# Altium schematic sheet STM32F100CBT6env.SchDoc
size A4
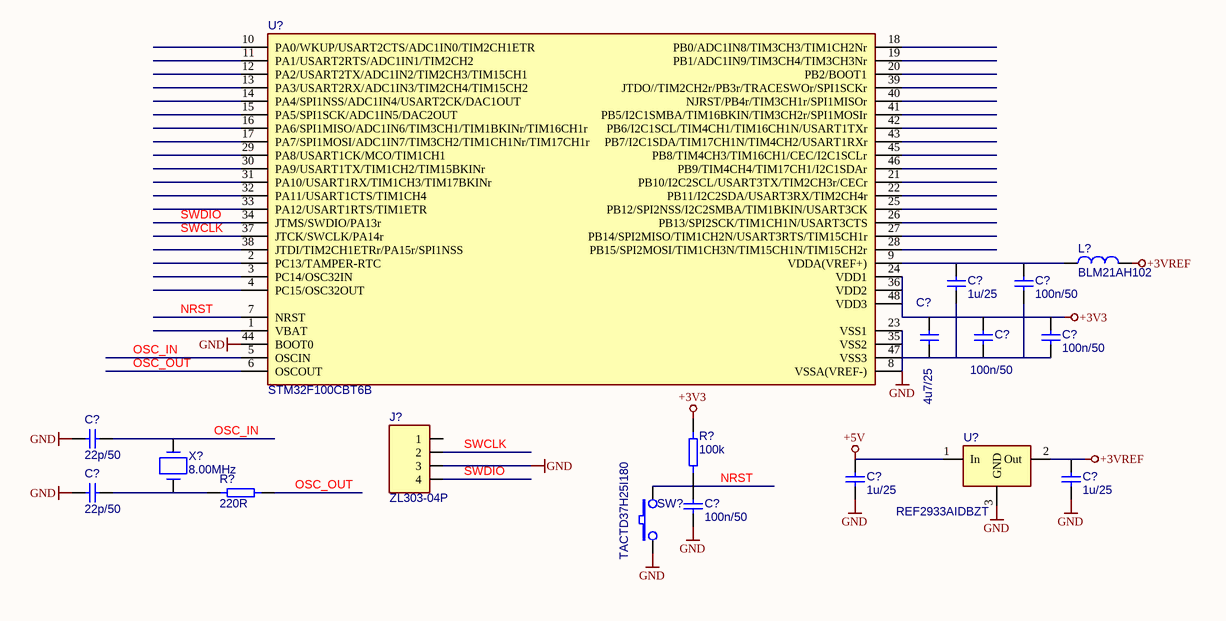
[diagram p0: STM32F100CBT6env.SchDoc]

## Parts
(Parts that share a designator on the sheet are numbered #1, #2 ... from top to bottom, then left to right.)
C?#1  1u/25  [0805]
C?#2  100n/50  [0805]
C?#3  4u7/25  [1206-IPC]
C?#4  100n/50  [0805]
C?#5  100n/50  [0805]
C?#6  22p/50  [0805]
C?#7  1u/25  [0805]
C?#8  1u/25  [0805]
C?#9  100n/50  [0805]
C?#10  22p/50  [0805]
J?  ZL303-04P  [PLMS4S]
L?  BLM21AH102  [0805]
R?#1  100k  [0805]
R?#2  220R  [0805]
SW?  TACTD37H25I180  [TACTD37H25I180]
U?#1  STM32F100CBT6B  [MS-026ABC]
U?#2  REF2933AIDBZT  [SOT23-3]
X?  8.00MHz  [HC49SMP]

## Nets
+3V3: C?#3.1 C?#4.1 C?#5.1 R?#1.1 U?#1.24(VDD1) U?#1.36(VDD2) U?#1.48(VDD3)
+3VREF: C?#8.1 L?.2 U?#2.2(Out)
+5V: C?#7.1 U?#2.1(In)
GND: C?#1.2 C?#2.2 C?#3.2 C?#4.2 C?#5.2 C?#6.1 C?#7.2 C?#8.2 C?#9.2 C?#10.1 J?.3 SW?.1 U?#1.8(VSSA(VREF-)) U?#1.23(VSS1) U?#1.35(VSS2) U?#1.44(BOOT0) U?#1.47(VSS3) U?#2.3(GND)
NRST: C?#9.1 R?#1.2 SW?.2 U?#1.7(NRST)
OSC_IN: C?#6.2 U?#1.5(OSCIN) X?.1
OSC_OUT: R?#2.2 U?#1.6(OSCOUT)
SWCLK: J?.2 U?#1.37(JTCK/SWCLK/PA14r)
SWDIO: J?.4 U?#1.34(JTMS/SWDIO/PA13r)
NetC?#1_1: C?#1.1 C?#2.1 L?.1 U?#1.9(VDDA(VREF+))
NetC?#10_2: C?#10.2 R?#2.1 X?.2

Not connected (* = marked no-connect by the designer): J? 1; U?#1 1(VBAT) 2(PC13/TAMPER-RTC) 3(PC14/OSC32IN) 4(PC15/OSC32OUT) 10(PA0/WKUP/USART2CTS/ADC1IN0/TIM2CH1ETR) 11(PA1/USART2RTS/ADC1IN1/TIM2CH2) 12(PA2/USART2TX/ADC1IN2/TIM2CH3/TIM15CH1) 13(PA3/USART2RX/ADC1IN3/TIM2CH4/TIM15CH2) 14(PA4/SPI1NSS/ADC1IN4/USART2CK/DAC1OUT) 15(PA5/SPI1SCK/ADC1IN5/DAC2OUT) 16(PA6/SPI1MISO/ADC1IN6/TIM3CH1/TIM1BKINr/TIM16CH1r) 17(PA7/SPI1MOSI/ADC1IN7/TIM3CH2/TIM1CH1Nr/TIM17CH1r) 18(PB0/ADC1IN8/TIM3CH3/TIM1CH2Nr) 19(PB1/ADC1IN9/TIM3CH4/TIM3CH3Nr) 20(PB2/BOOT1) 21(PB10/I2C2SCL/USART3TX/TIM2CH3r/CECr) 22(PB11/I2C2SDA/USART3RX/TIM2CH4r) 25(PB12/SPI2NSS/I2C2SMBA/TIM1BKIN/USART3CK) 26(PB13/SPI2SCK/TIM1CH1N/USART3CTS) 27(PB14/SPI2MISO/TIM1CH2N/USART3RTS/TIM15CH1r) 28(PB15/SPI2MOSI/TIM1CH3N/TIM15CH1N/TIM15CH2r) 29(PA8/USART1CK/MCO/TIM1CH1) 30(PA9/USART1TX/TIM1CH2/TIM15BKINr) 31(PA10/USART1RX/TIM1CH3/TIM17BKINr) 32(PA11/USART1CTS/TIM1CH4) 33(PA12/USART1RTS/TIM1ETR) 38(JTDI/TIM2CH1ETRr/PA15r/SPI1NSS) 39(JTDO//TIM2CH2r/PB3r/TRACESWOr/SPI1SCKr) 40(NJRST/PB4r/TIM3CH1r/SPI1MISOr) 41(PB5/I2C1SMBA/TIM16BKIN/TIM3CH2r/SPI1MOSIr) 42(PB6/I2C1SCL/TIM4CH1/TIM16CH1N/USART1TXr) 43(PB7/I2C1SDA/TIM17CH1N/TIM4CH2/USART1RXr) 45(PB8/TIM4CH3/TIM16CH1/CEC/I2C1SCLr) 46(PB9/TIM4CH4/TIM17CH1/I2C1SDAr)

## Library data of the parts
C?#1 C?#7 C?#8 = 38: Value: CL21B105KAFNNNG; MaxVoltage: 25V; Tolerance: 10%; Descript: Kondensator: ceramiczny; MLCC; 1uF; 25V; X7R; ±10%; SMD; 0805; Currency5: PLN; Identyfikator: 38; OtherParams: 1u/25; Dimensions: 0805; Supplier5: tme.pl; Reference5: CL21B105KAFNNNG; Manufacturer5: Samsung; Typ5: CL21B105KAFNNNG; Price5: 0,06; DateOfPrice5: 2017-05-15
C?#2 C?#4 C?#5 C?#9 = 7: Value: CL21B104KBCNNNC; MaxVoltage: 50V; Tolerance: 10%; Descript: capacitor 100nF/50V, 0805, X7R, 10%; Currency5: PLN; Identyfikator: 7; OtherParams: 100n/50; Dimensions: 0805; Supplier5: tme.pl; Reference5: CL21B104KBCNNNC; Manufacturer5: Samsung; Typ5: CL21B104KBCNNNC; Price5: 0,04; DateOfPrice5: 2017-11-07
C?#3 = 98: Value: 12063C475KAT2A; MaxVoltage: 25V; Tolerance: 10%; Descript: capacitor 4.7uF,25V, X7R, 1206; Currency5: PLN; Identyfikator: 98; OtherParams: 4u7/25; Dimensions: 1206; Supplier5: tme.pl; Reference5: 12063C475KAT2A; Manufacturer5: AVX; Typ5: 12063C475KAT2A; Price5: 0,299; DateOfPrice5: 2012-08-02
C?#6 C?#10 = 54: Value: CL21C220JBANNNC; MaxVoltage: 50V; Tolerance: 5%; Descript: capacitor 22pF, 50V, COG 5%, 805; Currency5: PLN; Identyfikator: 54; OtherParams: 22p/50; Dimensions: 0805; Supplier5: tme.pl; Reference5: CL21C220JBANNNC; Manufacturer5: Samsung; Typ5: CL21C220JBANNNC; Price5: 0,04; DateOfPrice5: 2017-07-03
J? = 298: Descript: connector 2.00mm pitch, 4 poles, one row; Currency5: PLN; Identyfikator: 298; Value: ZL303-04P; Dimensions: 4x2mm; Supplier5: tme.pl; Reference5: ZL303-04P; Price5: 0,25; DateOfPrice5: 2017-06-09; Manufacturer5: Ninigi; Typ5: ZL303-04P
L? = 43: Identyfikator: 43; Descript: choke 0.2A, 0.45ohm; Reference5: BLM21AH102SN1D; Currency5: PLN; Value: BLM21AH102; OtherParams: BLM21AH102; Dimensions: 0805; Supplier5: tme.pl; Manufacturer5: Murata; Price5: 0,42; Typ5: BLM21AH102SN1D; DateOfPrice5: 2017-05-29
R?#1 = 10: Value: 0805WAF 100K T5E; Descript: Resistor 100kohm, 0805, 1%; DissPower: 0.125W; Tolerance: 1%; Reference5: SMD0805-100K-1%; Currency5: PLN; Identyfikator: 10; OtherParams: 100k; Dimensions: 0805; Supplier5: tme.pl; Manufacturer5: Royal Ohm; Typ5: 0805WAF 100K T5E; Price5: 0,04; DateOfPrice5: 2017-06-09
R?#2 = 88: Value: 0805WAF 220R T5E; DissPower: 0.125W; Tolerance: 1%; Descript: Resistor 220ohm, 0805, 1%; Reference5: SMD0805-220R-1%; Currency5: PLN; Identyfikator: 88; OtherParams: 220R; Dimensions: 0805; Supplier5: tme.pl; Manufacturer5: Royal Ohm; Typ5: 0805WAF 220R T5E; Price5: 0,04; DateOfPrice5: 2017-06-09
SW? = 38: Descript: TACT switch 3.7x6.1x2.5, SMD, dustproof; Currency5: PLN; Identyfikator: 38; Value: TACTD37H25I180; Dimensions: 3.7x6.1x2.5; Supplier5: maritex.com.pl; Reference5: TACTD37H25I180; Price5: 0,55; DateOfPrice5: 2017-05-29; OtherParams: TACTD37H25I180; Manufacturer5: www.innocentswitch.co.kr
U?#1 = 268: Descript: MCU, 32BIT, CORTEXM3, 128K FLASH, 48LQFP; Reference5: 1838512; Currency5: PLN; Identyfikator: 268; Value: STM32F100CBT6B; Dimensions: MS-026ABC; Supplier5: farnell.com; Manufacturer5: ST; Typ5: STM32F100CBT6B; Price5: 15,21; DateOfPrice5: 2014-09-09
U?#2 = 236: Descript: 100ppm/°C, 50µA in SOT23-3 CMOS VOLTAGE REFERENCE; Reference5: 1459250; Currency5: PLN; Identyfikator: 236; Value: REF2933AIDBZT; Dimensions: SOT23-3; Supplier5: farnell.com; Manufacturer5: Texas Instruments; Typ5: REF2933AIDBZT; Price5: 7,22; DateOfPrice5: 2017-09-29
X? = 16: Descript: crystal 8MHz, 1; Reference5: 8.00M-SMDHC49S; Currency5: PLN; Identyfikator: 16; Value: 8.00MHz; OtherParams: 8.00MHz; Dimensions: HC49/4HSMX; Supplier5: tme.pl; Price5: 1,85; DateOfPrice5: 2017-09-25; Manufacturer5: YIC